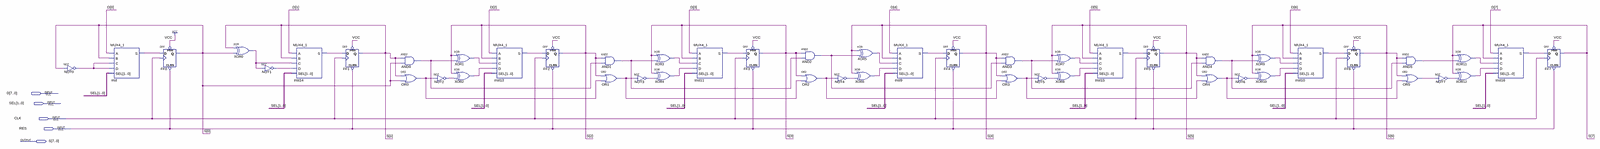
[diagram p0: schematic sheet, whole]
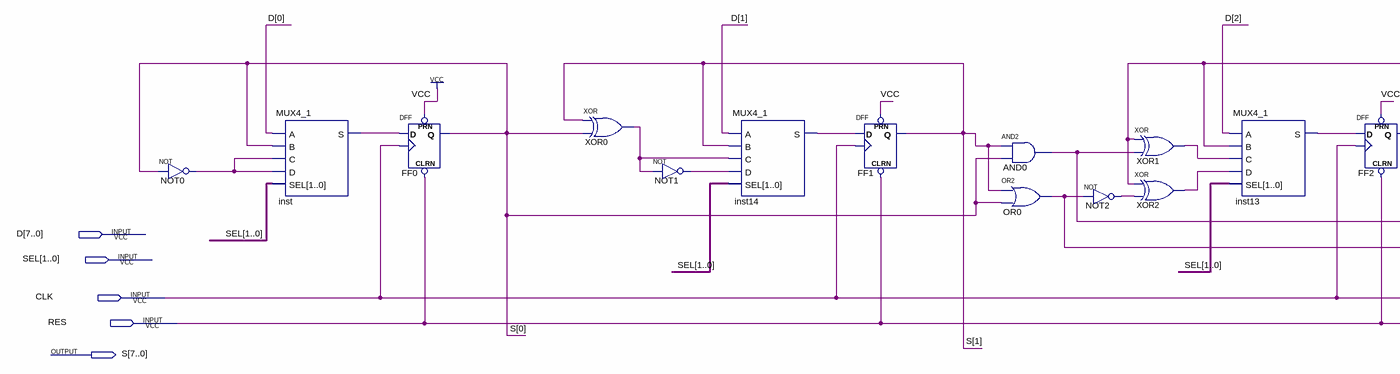
[diagram p1: schematic sheet, left part]
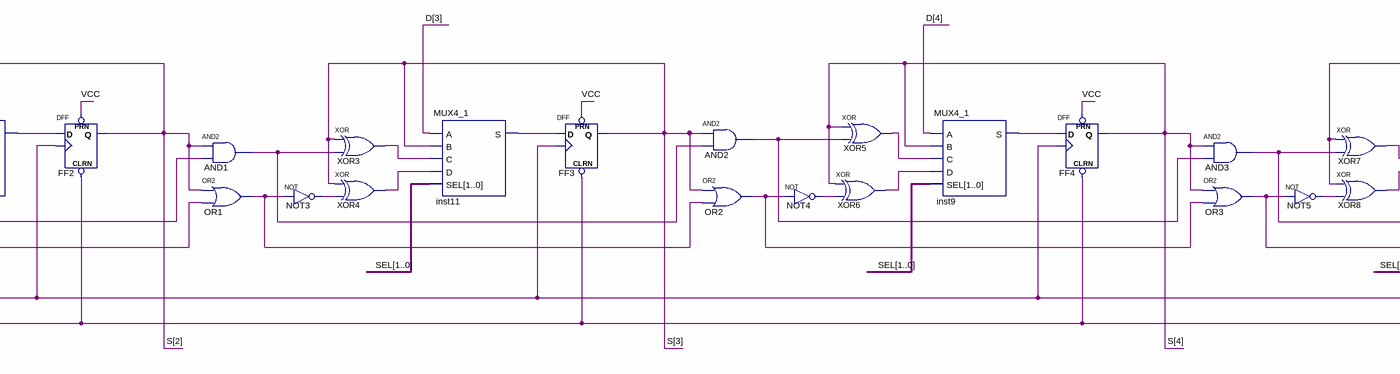
[diagram p2: schematic sheet, centre part]
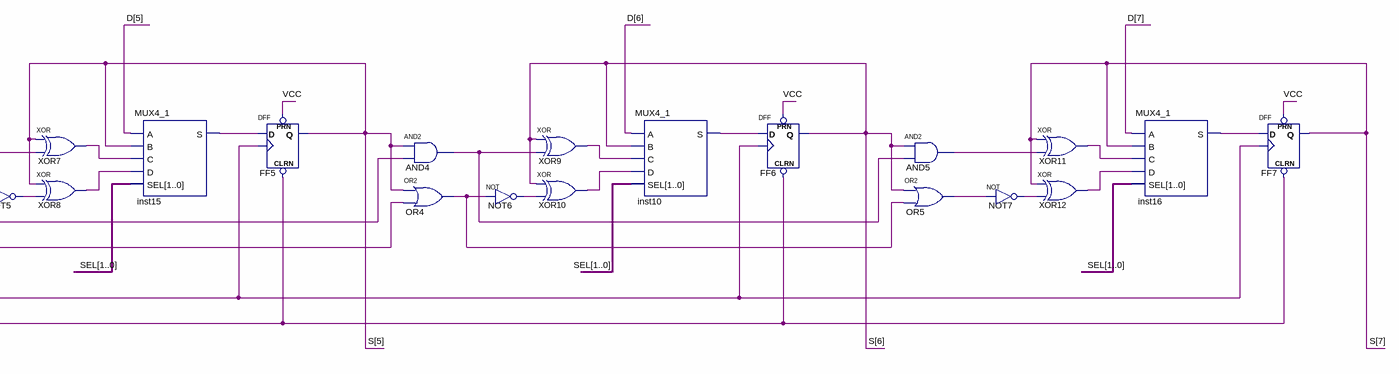
[diagram p3: schematic sheet, right part]
// Quartus schematic reg_up_down_counter.bdf as structural Verilog: 49 symbols, 5 pins
module reg_up_down_counter (
  input  [7:0] D,
  input  [1:0] SEL,
  input  CLK,
  input  RES,
  output [7:0] S
);

  wire AND0_out, AND1_out, AND2_out, AND3_out, AND4_out, AND5_out, inst9_s, inst10_s, inst11_s, inst13_s,
       inst14_s, inst15_s, inst16_s, inst_s, NOT0_out, NOT1_out, NOT2_out, NOT3_out, NOT4_out, NOT5_out,
       NOT6_out, NOT7_out, OR0_out, OR1_out, OR2_out, OR3_out, OR4_out, OR5_out, XOR0_out, XOR1_out,
       XOR2_out, XOR3_out, XOR4_out, XOR5_out, XOR6_out, XOR7_out, XOR8_out, XOR9_out, XOR10_out, XOR11_out,
       XOR12_out;

  not NOT0 (NOT0_out, S[0]);
  MUX4_1 inst (.A(D[0]), .B(S[0]), .C(NOT0_out), .D(NOT0_out), .SEL(SEL), .S(inst_s));
  DFF FF0 (.CLRN(RES), .CLK(CLK), .D(inst_s), .PRN(1'b1), .Q(S[0]));
  xor XOR0 (XOR0_out, S[1], S[0]);
  not NOT1 (NOT1_out, XOR0_out);
  MUX4_1 inst14 (.A(D[1]), .B(S[1]), .C(XOR0_out), .D(NOT1_out), .SEL(SEL), .S(inst14_s));
  DFF FF1 (.CLRN(RES), .CLK(CLK), .D(inst14_s), .PRN(1'b1), .Q(S[1]));
  and AND0 (AND0_out, S[1], S[0]);
  or OR0 (OR0_out, S[1], S[0]);
  not NOT2 (NOT2_out, OR0_out);
  xor XOR1 (XOR1_out, S[2], AND0_out);
  xor XOR2 (XOR2_out, S[2], NOT2_out);
  MUX4_1 inst13 (.A(D[2]), .B(S[2]), .C(XOR1_out), .D(XOR2_out), .SEL(SEL), .S(inst13_s));
  DFF FF2 (.CLRN(RES), .CLK(CLK), .D(inst13_s), .PRN(1'b1), .Q(S[2]));
  and AND1 (AND1_out, S[2], AND0_out);
  or OR1 (OR1_out, S[2], OR0_out);
  not NOT3 (NOT3_out, OR1_out);
  xor XOR3 (XOR3_out, S[3], AND1_out);
  xor XOR4 (XOR4_out, S[3], NOT3_out);
  MUX4_1 inst11 (.A(D[3]), .B(S[3]), .C(XOR3_out), .D(XOR4_out), .SEL(SEL), .S(inst11_s));
  DFF FF3 (.CLRN(RES), .CLK(CLK), .D(inst11_s), .PRN(1'b1), .Q(S[3]));
  and AND2 (AND2_out, S[3], AND1_out);
  or OR2 (OR2_out, S[3], OR1_out);
  not NOT4 (NOT4_out, OR2_out);
  xor XOR5 (XOR5_out, S[4], AND2_out);
  xor XOR6 (XOR6_out, S[4], NOT4_out);
  MUX4_1 inst9 (.A(D[4]), .B(S[4]), .C(XOR5_out), .D(XOR6_out), .SEL(SEL), .S(inst9_s));
  DFF FF4 (.CLRN(RES), .CLK(CLK), .D(inst9_s), .PRN(1'b1), .Q(S[4]));
  and AND3 (AND3_out, S[4], AND2_out);
  or OR3 (OR3_out, S[4], OR2_out);
  not NOT5 (NOT5_out, OR3_out);
  xor XOR7 (XOR7_out, S[5], AND3_out);
  xor XOR8 (XOR8_out, S[5], NOT5_out);
  MUX4_1 inst15 (.A(D[5]), .B(S[5]), .C(XOR7_out), .D(XOR8_out), .SEL(SEL), .S(inst15_s));
  DFF FF5 (.CLRN(RES), .CLK(CLK), .D(inst15_s), .PRN(1'b1), .Q(S[5]));
  and AND4 (AND4_out, S[5], AND3_out);
  or OR4 (OR4_out, S[5], OR3_out);
  not NOT6 (NOT6_out, OR4_out);
  xor XOR9 (XOR9_out, S[6], AND4_out);
  xor XOR10 (XOR10_out, S[6], NOT6_out);
  MUX4_1 inst10 (.A(D[6]), .B(S[6]), .C(XOR9_out), .D(XOR10_out), .SEL(SEL), .S(inst10_s));
  DFF FF6 (.CLRN(RES), .CLK(CLK), .D(inst10_s), .PRN(1'b1), .Q(S[6]));
  and AND5 (AND5_out, S[6], AND4_out);
  or OR5 (OR5_out, S[6], OR4_out);
  not NOT7 (NOT7_out, OR5_out);
  xor XOR11 (XOR11_out, S[7], AND5_out);
  xor XOR12 (XOR12_out, S[7], NOT7_out);
  MUX4_1 inst16 (.A(D[7]), .B(S[7]), .C(XOR11_out), .D(XOR12_out), .SEL(SEL), .S(inst16_s));
  DFF FF7 (.CLRN(RES), .CLK(CLK), .D(inst16_s), .PRN(1'b1), .Q(S[7]));
endmodule
